# EAGLE design ArduinoUNOSheild (EAGLE 9.6.2)
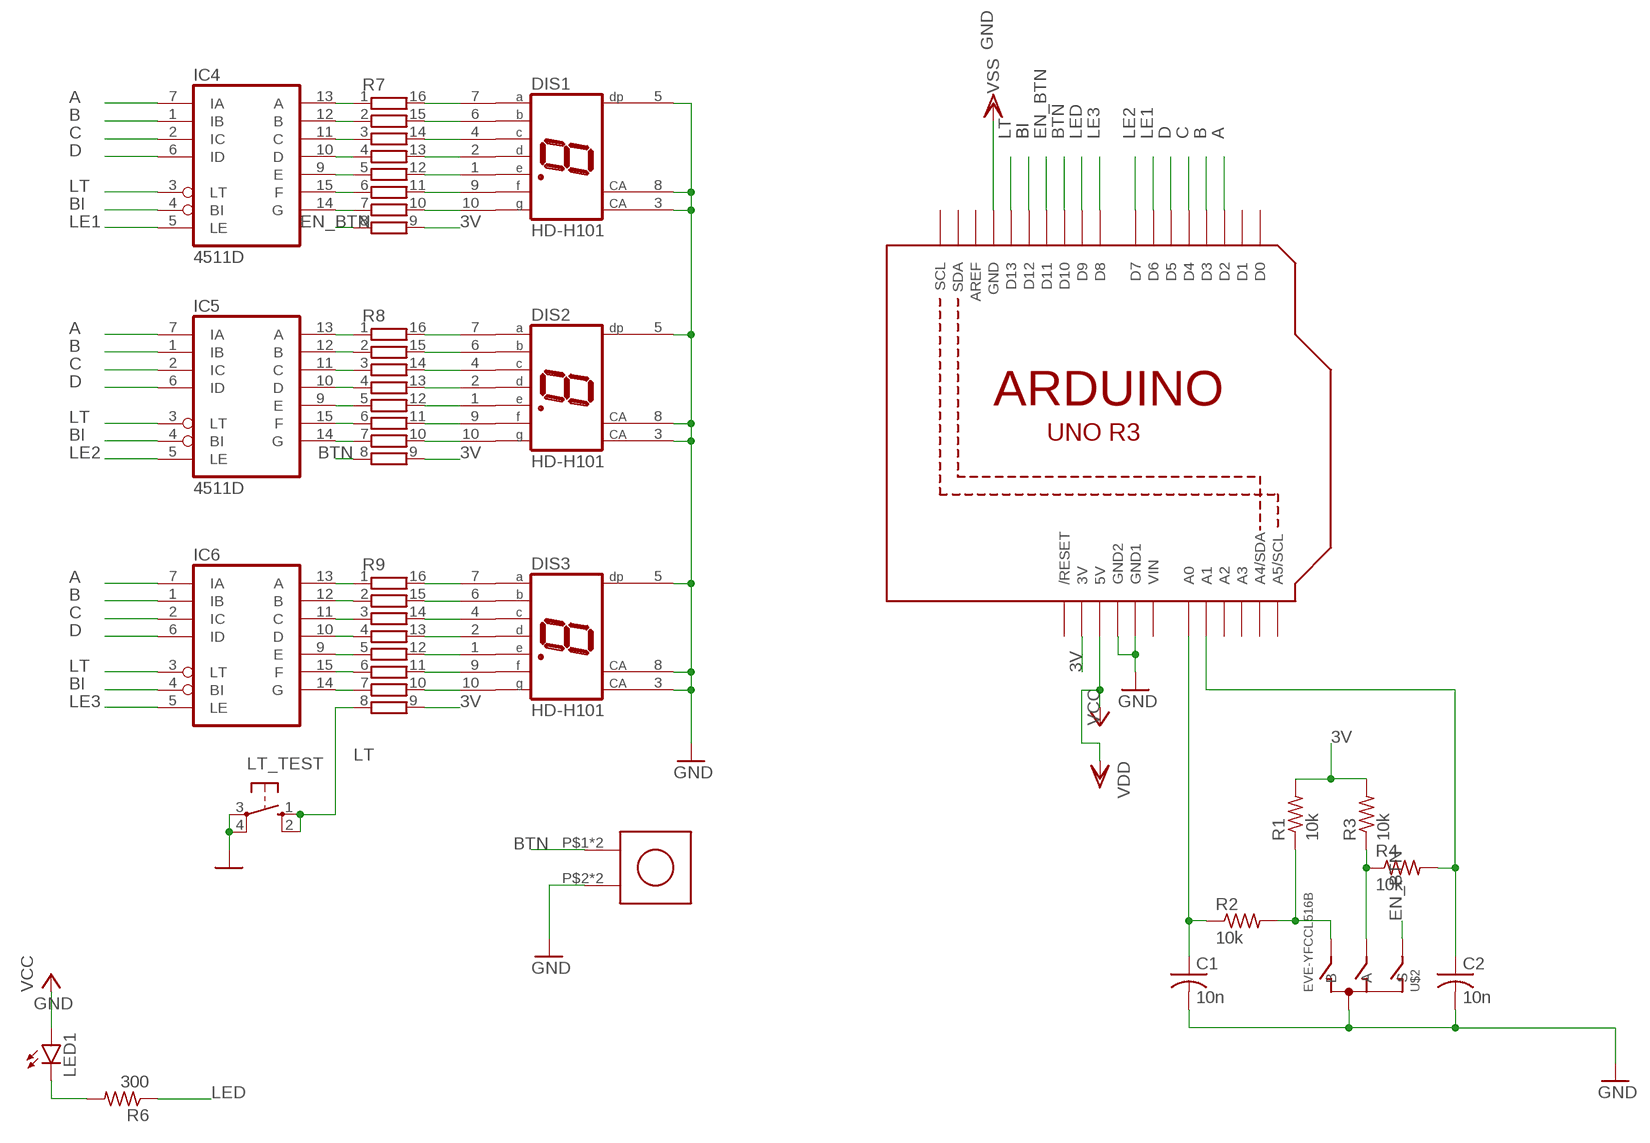
[diagram p0: schematic, sheet 1]

## Parts
C1  10n  C-USC0603  [C0603]
C2  10n  C-USC0603  [C0603]
DIS1  HD-H101  [HDSP-M]
DIS2  HD-H101  [HDSP-M]
DIS3  HD-H101  [HDSP-M]
IC4  4511D  [SO16]
IC5  4511D  [SO16]
IC6  4511D  [SO16]
LED1  LEDCHIP-LED0805  [CHIP-LED0805]
LT_TEST  10-XX  [B3F-10XX]
R1  10k  R-US_R0603  [R0603]
R2  10k  R-US_R0603  [R0603]
R3  10k  R-US_R0603  [R0603]
R4  10k  R-US_R0603  [R0603]
R6  300  R-US_R0603  [R0603]
R7  4816P-T01  [4816P]
R8  4816P-T01  [4816P]
R9  4816P-T01  [4816P]
U1  ARDUINOR3-NOIOREF-NOTEXT  [ARDUINOR3-NOTEXT-NOIOREF]
U$1  AE1027  [BUTTON5X13MM]
U$2  EVE-YFCCL516B  [PANASONIC_EVE_Y]

## Nets
3V: R1.2 R3.2 R7.9 R8.9 R9.9 U1.3V
A: IC4.7(IA) IC5.7(IA) IC6.7(IA) U1.D2
A1: C2.1 R4.2 U1.A1
B: IC4.1(IB) IC5.1(IB) IC6.1(IB) U1.D3
BI: IC4.4(BI) IC5.4(BI) IC6.4(BI) U1.D12
BTN: R8.8 U1.D10 U$1.P$1 U$1.P$11
C: IC4.2(IC) IC5.2(IC) IC6.2(IC) U1.D4
D: IC4.6(ID) IC5.6(ID) IC6.6(ID) U1.D5
EN_BTN: R7.8 U1.D11 U$2.S
GND: C1.2 C2.2 DIS1.3(CA) DIS1.5(DP) DIS1.8(CA) DIS2.3(CA) DIS2.5(DP) DIS2.8(CA) DIS3.3(CA) DIS3.5(DP) DIS3.8(CA) LT_TEST.3(P) LT_TEST.4(P1) U1.GND U1.GND1 U1.GND2 U$1.P$2 U$1.P$12 U$2.COM(C) U$2.GND1(C) U$2.GND(C) ; supply symbol labelled VSS
LE1: IC4.5(LE) U1.D6
LE2: IC5.5(LE) U1.D7
LE3: IC6.5(LE) U1.D8
LED: R6.1 U1.D9
LED_N: LED1.C R6.2
LT: IC4.3(LT) IC5.3(LT) IC6.3(LT) LT_TEST.1(S) LT_TEST.2(S1) R9.8 U1.D13
N$1: DIS1.7(A) R7.16
N$2: DIS1.6(B) R7.15
N$3: DIS1.4(C) R7.14
N$4: DIS1.2(D) R7.13
N$5: DIS1.1(E) R7.12
N$7: DIS1.9(F) R7.11
N$8: DIS1.10(G) R7.10
N$9: DIS2.7(A) R8.16
N$10: DIS2.6(B) R8.15
N$11: DIS2.4(C) R8.14
N$12: DIS2.2(D) R8.13
N$13: DIS2.1(E) R8.12
N$14: DIS2.9(F) R8.11
N$15: DIS2.10(G) R8.10
N$16: DIS3.7(A) R9.16
N$17: DIS3.6(B) R9.15
N$18: DIS3.4(C) R9.14
N$19: DIS3.2(D) R9.13
N$20: DIS3.1(E) R9.12
N$21: DIS3.9(F) R9.11
N$22: DIS3.10(G) R9.10
N$23: R1.1 R2.2 U$2.B U$2.B1(B)
N$24: C1.1 R2.1 U1.A0
N$26: R3.1 R4.1 U$2.A
N$27: IC4.13(A) R7.1
N$28: IC4.12(B) R7.2
N$29: IC4.11(C) R7.3
N$30: IC4.10(D) R7.4
N$31: IC4.9(E) R7.5
N$32: IC4.15(F) R7.6
N$33: IC4.14(G) R7.7
N$34: IC5.13(A) R8.1
N$35: IC5.12(B) R8.2
N$36: IC5.11(C) R8.3
N$37: IC5.10(D) R8.4
N$38: IC5.9(E) R8.5
N$39: IC5.15(F) R8.6
N$40: IC5.14(G) R8.7
N$41: IC6.13(A) R9.1
N$42: IC6.12(B) R9.2
N$43: IC6.11(C) R9.3
N$44: IC6.10(D) R9.4
N$45: IC6.9(E) R9.5
N$46: IC6.15(F) R9.6
N$47: IC6.14(G) R9.7
VCC: LED1.A U1.5V ; supply symbol labelled VDD, +5V
Unconnected: U1.A2 U1.A3 U1.A4(A4/SDA) U1.A5(A5/SCL) U1.AREF U1.D0 U1.D1 U1.RESET(/RESET) U1.SCL U1.SDA

## Power pins joined to a net without a drawn wire
GND: IC4.8(VSS) IC5.8(VSS) IC6.8(VSS)
VCC: IC4.16(VDD) IC5.16(VDD) IC6.16(VDD)
VIN: U1.VIN

## Library data of the parts
C1 C2 = rcl:C-US: CAPACITOR, American symbol; SPICEPREFIX: C
DIS1-DIS3 = display-hp:HD-H101: LED DISPLAY 1-character 7 segment, decimal point right; OC_FARNELL: unknown; OC_NEWARK: unknown
IC4-IC6 = 45xx:4511: BCD to 7-segment LATCH/DECODER/DRIVER
LED1 = led:LED: LED OSRAM: - CHIPLED LG R971, LG N971, LY N971, LG Q971, LY Q971, LO R971, LY R971 LH N974, LH R974 LS Q976, LO Q976, LY Q976 LO Q996 - Hyper CHIPLED LW Q18S LB Q993, LB Q99A, LB R99A - SideLED LS A670, LO A670, LY A670, LG A670, LP A670 LB A673, LV A673, LT A673, LW A673 LH A674 LY A675 LS A676, LA A676, LO A676, LY A676, LW A676 LS A679, LY A679, LG A679 - Hyper Micro SIDELED® LS Y876, LA Y876, LO Y876, LY Y876 LT Y87S - SmartLED LW L88C, LW L88S LB L89C, LB L89S, LG L890 LS L89K, LO L89K, LY L89K LS L896, LA L896, LO L896, LY L896 - TOPLED LS T670, LO T670, LY T670, LG T670, LP T670 LSG T670, LSP T670, LSY T670, LOP T670, LYG T670 LG T671, LOG T671, LSG T671 LB T673, LV T673, LT T673, LW T673 LH T674 LS T676, LA T676, LO T676, LY T676, LB T676, LH T676, LSB T676, LW T676 LB T67C, LV T67C, LT T67C, LS T67K, LO T67K, LY T67K, LW E67C LS E67B, LA E67B, LO E67B, LY E67B, LB E67C, LV E67C, LT E67C LW T67C LS T679, LY T679, LG T679 LS T770, LO T770, LY T770, LG T770, LP T770 LB T773, LV T773, LT T773, LW T773 LH T774 LS E675, LA E675, LY E675, LS T675 LS T776, LA T776, LO T776, LY T776, LB T776 LHGB T686 LT T68C, LB T68C - Hyper Mini TOPLED® LB M676 - Mini TOPLED Santana® LG M470 LS M47K, LO M47K, LY M47K Source: http://www.osram.convergy.de LUXEON: - LUMILED® LXK2-PW12-R00, LXK2-PW12-S00, LXK2-PW14-U00, LXK2-PW14-V00 LXK2-PM12-R00, LXK2-PM12-S00, LXK2-PM14-U00 LXK2-PE12-Q00, LXK2-PE12-R00, LXK2-PE12-S00, LXK2-PE14-T00, LXK2-PE14-U00 LXK2-PB12-K00, LXK2-PB12-L00, LXK2-PB12-M00, LXK2-PB14-N00, LXK2-PB14-P00, LXK2-PB14-Q00 LXK2-PR12-L00, LXK2-PR12-M00, LXK2-PR14-Q00, LXK2-PR14-R00 LXK2-PD12-Q00, LXK2-PD12-R00, LXK2-PD12-S00 LXK2-PH12-R00, LXK2-PH12-S00 LXK2-PL12-P00, LXK2-PL12-Q00, LXK2-PL12-R00 Source: www.luxeon.com KINGBRIGHT: KA-3528ASYC Source: www.kingbright.com
LT_TEST = switch-omron:10-XX: OMRON SWITCH; MPN: B3F-1000; OC_FARNELL: 176432; OC_NEWARK: 36M3542
R1-R4 R6 = rcl:R-US_: RESISTOR, American symbol; SPICEPREFIX: R
R7-R9 = resistor-bourns:4816P-T01: BOURNS RESISTOR NETWORK; MF: BOURNS, INC.; MPN: 4816P-T01-684LF; OC_FARNELL: 9357483; OC_NEWARK: 33K0707
U1 = adafruit:ARDUINOR3-NOIOREF
U$1 = Button12mm:AE1027: AE1027 Gikfun 12*12*7.3mm Tact Tactile Button/Press Switch
U$2 = EVE-YFCCL516B:EVE-YFCCL516B

## Net classes
0 default: width 0.051 mm, drill 0.076 mm, clearance 0.051 mm

## Board
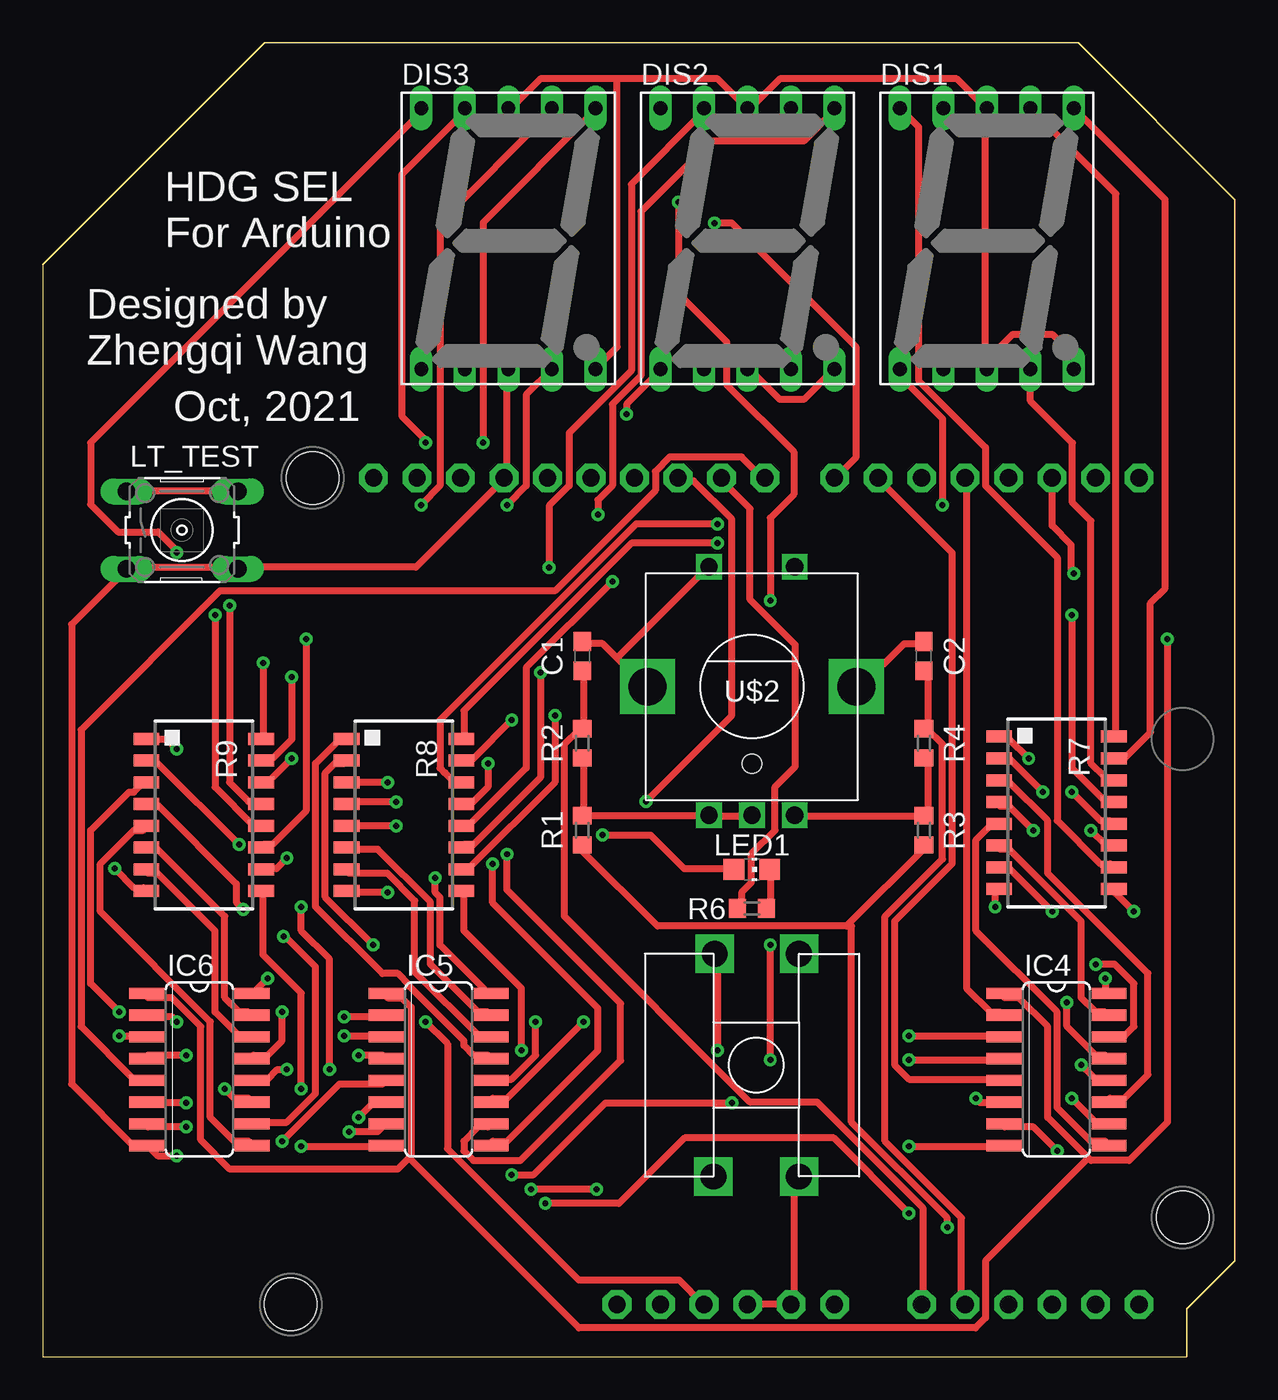
[diagram p1: board, top side]
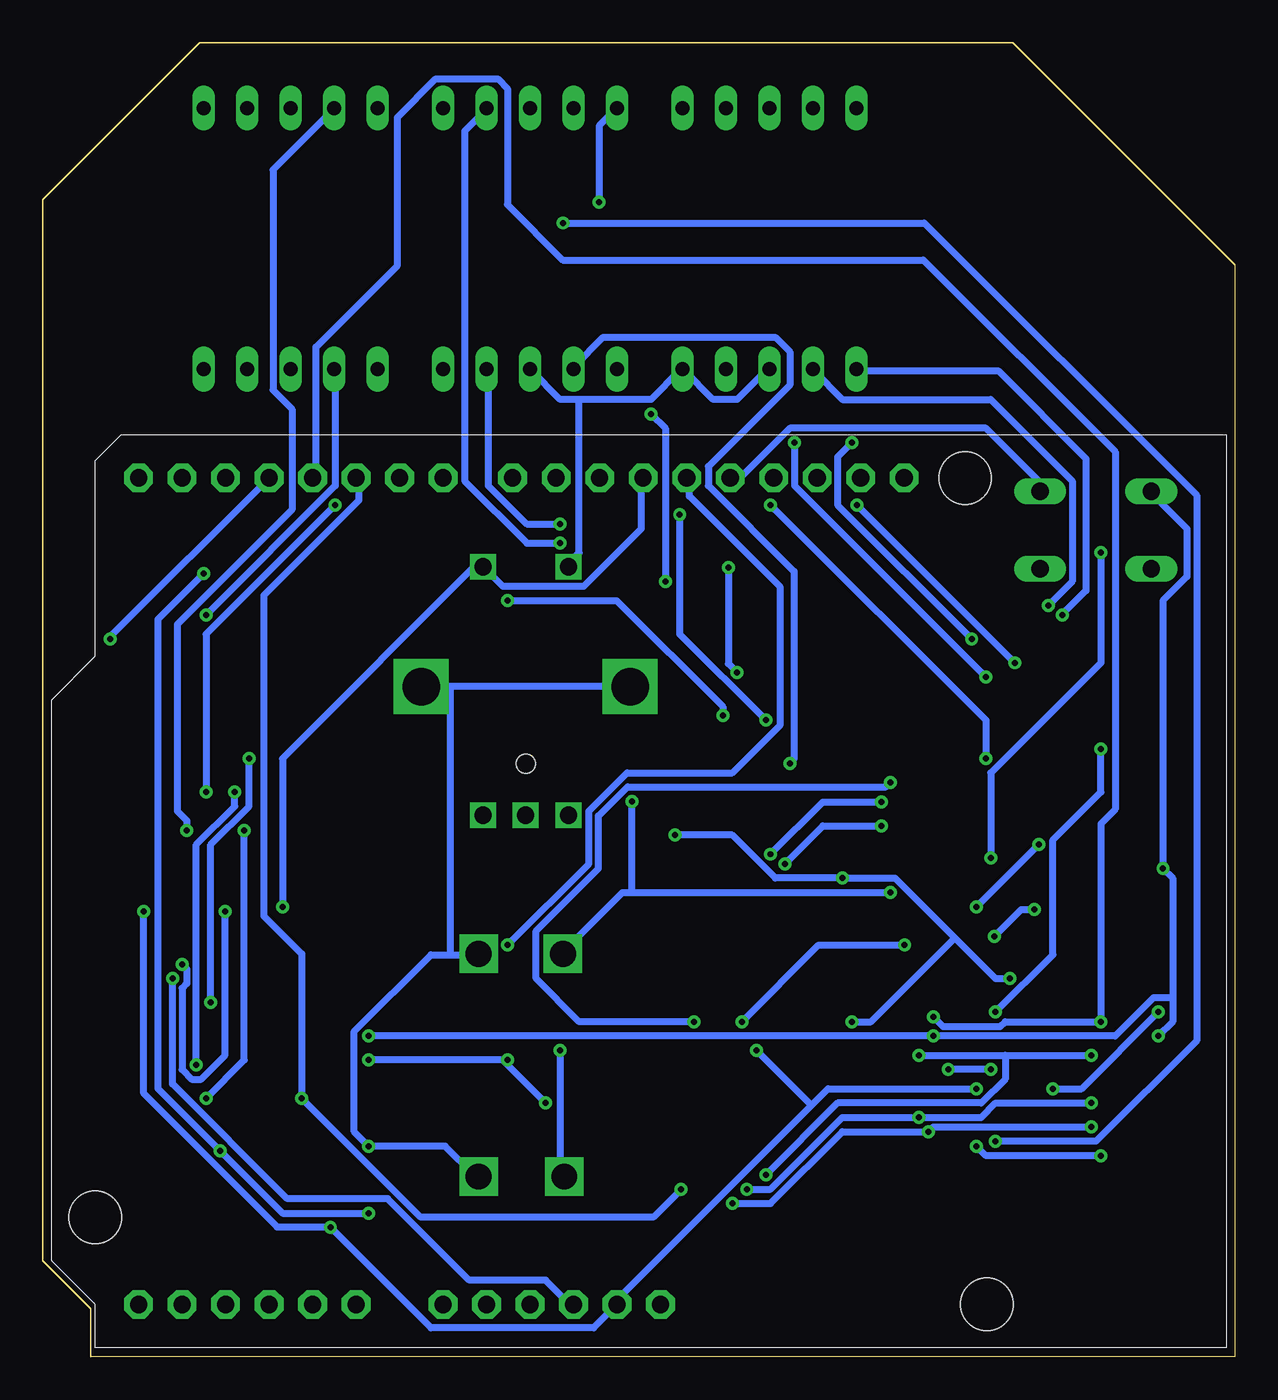
[diagram p2: board, bottom side, seen from below]

Size 69.6 x 76.71 mm. Coordinates in mm from the lower left corner, seen from the top.
Outline: 0,0 66.8,0 66.8,2.79 69.6,5.59 69.6,67.56 60.45,76.71 12.95,76.71 0,63.75 0,0
Copper layers (1*16): Top 0.035mm / dielectric 1.5mm / Bottom 0.035mm
Design rules "default *": minimum track width 16mil, minimum drill 0.35mm, track to track 6mil, track to pad 6mil, pad to pad 6mil, via to via 6mil, smd to smd 6mil, copper to edge 40mil, drill to drill 6mil, minimum pad ring 10mil, minimum via ring 8mil, stop-mask expansion 4mil, vias tented up to drill 0mil, thermal gap 10mil
Holes 3.05 mm at 14.48,3.05 66.55,8.13 15.75,51.31

### Footprints (pad centres in the part's own frame; a part is rotated, then mirrored left to right if it is on the bottom)
C0603 = smd 1.1 x 1: 1 -0.85,0; 2 0.85,0
HDSP-M = drill 0.813 long: 1 -5.08,-7.62; 2 -2.54,-7.62; 3 0,-7.62; 4 2.54,-7.62; 5 5.08,-7.62; 6 5.08,7.62; 7 2.54,7.62; 8 0,7.62; 9 -2.54,7.62; 10 -5.08,7.62
SO16 = smd 0.66 x 2.032: 1 -4.445,-3.073; 2 -3.175,-3.073; 3 -1.905,-3.073; 4 -0.635,-3.073; 5 0.635,-3.073; 6 1.905,-3.073; 7 3.175,-3.073; 8 4.445,-3.073; 9 4.445,3.073; 10 3.175,3.073; 11 1.905,3.073; 12 0.635,3.073; 13 -0.635,3.073; 14 -1.905,3.073; 15 -3.175,3.073; 16 -4.445,3.073
CHIP-LED0805 = smd 1.2 x 1.2: A 0,-1.05; C 0,1.05
B3F-10XX = drill 1.016 long: 1 -3.251,2.261; 2 3.251,2.261; 3 -3.251,-2.261; 4 3.251,-2.261
R0603 = smd 1 x 1.1: 1 -0.85,0; 2 0.85,0
4816P = smd 0.7 x 1.5: 1 -4.445,-3.346; 2 -3.175,-3.346; 3 -1.905,-3.346; 4 -0.635,-3.346; 5 0.635,-3.346; 6 1.905,-3.346; 7 3.175,-3.346; 8 4.445,-3.346; 9 4.445,3.346; 10 3.175,3.346; 11 1.905,3.346; 12 0.635,3.346; 13 -0.635,3.346; 14 -1.905,3.346; 15 -3.175,3.346; 16 -4.445,3.346
ARDUINOR3-NOTEXT-NOIOREF = drill 1 pad 1.676 octagon: 3V 35.56,2.54; 5V 38.1,2.54; A0 50.8,2.54; A1 53.34,2.54; A2 55.88,2.54; A3 58.42,2.54; A4 60.96,2.54; A5 63.5,2.54; AREF 23.876,50.8; D0 63.5,50.8; D1 60.96,50.8; D2 58.42,50.8; D3 55.88,50.8; D4 53.34,50.8; D5 50.8,50.8; D6 48.26,50.8; D7 45.72,50.8; D8 41.656,50.8; D9 39.116,50.8; D10 36.576,50.8; D11 34.036,50.8; D12 31.496,50.8; D13 28.956,50.8; GND 26.416,50.8; GND1 43.18,2.54; GND2 40.64,2.54; RESET 33.02,2.54; SCL 18.796,50.8; SDA 21.336,50.8; VIN 45.72,2.54
BUTTON5X13MM = drill 1.5 square: P$1 -2.5,-6.5; P$2 2.5,-6.5; P$11 -2.424,6.5; P$12 2.5,6.5
PANASONIC_EVE_Y = drill 1 square: A 2.5,-7.5; B -2.5,-7.5; B1 0,-7.5; COM -2.5,7; S 2.5,7 | drill 2.2 square: GND -6.1,0; GND1 6.1,0 | hole 1.1: 0,-4.5

### Placement (x,y rotation side)
C1  31.5,40.89 90 top
C2  51.44,40.89 90 top
DIS1  55.12,65.28 0 top
DIS2  41.15,65.28 0 top
DIS3  27.18,65.28 0 top
IC4  59.18,16.76 270 top
IC5  23.11,16.76 270 top
IC6  9.14,16.76 270 top
LED1  41.4,28.45 270 top
LT_TEST  8.13,48.26 0 top
R1  31.5,30.73 270 top
R2  31.5,35.81 270 top
R3  51.44,30.73 270 top
R4  51.44,35.81 90 top
R6  41.4,26.16 0 top
R7  59.18,31.75 270 top
R8  21.08,31.62 270 top
R9  9.4,31.62 270 top
U1  0.51,0.51 0 top
U$1  41.65,17.02 0 top
U$2  41.4,39.12 0 top

### Tracks (layer width: path | path; a pad name or v marks a point on that pad's centre or on a via)
3V  (via drill 0.35)
  Top 0.406: R1.2 31.5,29.54 35.89,25.15 46.94,25.15 47.08,25.29 | 47.08,25.29 51.41,29.62 R3.2 | v15.09,15.65 15.09,21.23 12.85,23.47 12.85,27.1 R9.9 | v27.94,17.88 27.94,21.51 24.59,24.87 24.59,27.1 R8.9 | v63.7,25.98 62.59,27.1 R7.9 | v52.81,7.54 52.81,8.1 47.22,13.69 47.22,25.15 47.08,25.29
  Bottom 0.406: v15.09,15.65 23.75,15.65 24.73,14.67 | 24.73,14.67 36.32,3.07 U1.3V 37.44,1.68 46.94,1.68 v52.81,7.54 52.84,7.58 55.92,7.58 63.7,15.37 v63.7,25.98 | 24.73,14.67 v27.94,17.88
A  (via drill 0.35)
  Top 0.406: v8.38,13.41 6.15,13.41 IC6.7 | v17.88,13.13 19.56,13.13 19.84,13.41 IC5.7 | v59.23,12.01 57.84,13.41 56.16,13.41 IC4.7 | v29.34,8.94 33.63,8.94 37.47,12.78 46.18,12.78 v50.57,8.38 | v60.2,45.72 60.05,45.87 60.05,47.4 58.93,48.52 U1.D2
  Bottom 0.406: v8.38,13.41 17.6,13.41 v17.88,13.13 22.91,13.13 27.1,8.94 v29.34,8.94 | v50.57,8.38 55.6,8.38 v59.23,12.01 62.87,15.65 62.87,43.05 v60.2,45.72
A1
  Top 0.406: C2.1 51.69,39.95 51.69,36.88 R4.2 51.69,36.6 52.53,35.76 52.53,29.06 49.17,25.7 49.17,12.57 53.65,8.1 53.65,3.07 U1.A1
B  (via drill 0.35)
  Top 0.406: 21.37,11.6 21.51,11.73 21.51,20.4 20.95,20.95 20.12,20.95 IC5.1 | 21.37,11.6 20.73,10.95 10.92,10.95 9.22,12.65 9.22,19.28 7.54,20.95 6.15,20.95 IC6.1 | 61.05,11.6 61.19,11.46 63.42,11.46 65.66,13.69 v65.66,41.91 | 61.05,11.6 58.67,13.97 58.67,19.28 57,20.95 56.16,20.95 IC4.1 | 21.37,11.6 31.29,1.68 54.46,1.68 55.04,2.26 55.04,5.59 61.05,11.6
  Bottom 0.406: U1.D3 65.66,42.04 v65.66,41.91
BI  (via drill 0.35)
  Top 0.406: v8.38,17.6 6.15,17.6 IC6.4 | v18.44,17.6 19.84,17.6 IC5.4 | v50.57,17.32 55.88,17.32 IC4.4 | v40.23,14.81 32.84,14.81 28.65,10.62 v27.38,10.62 | v42.47,17.32 v42.47,24.03
  Bottom 0.406: v18.44,17.6 13.41,17.6 | 13.41,17.6 v8.38,17.6 | v50.57,17.32 42.75,17.32 42.61,17.18 | v40.23,14.81 42.61,17.18 | v27.38,10.62 23.19,14.81 14.81,14.81 13.41,16.2 13.41,17.6 | v42.47,24.03 37.72,28.78 37.72,31.85 35.48,34.09 29.34,34.09 26.54,36.88 26.54,44.93 31.85,50.24 31.85,51.13 U1.D12 | v42.47,17.32 42.61,17.18
BTN  (via drill 0.35)
  Top 0.406: v20.12,27.1 17.88,27.1 R8.8 | v35.2,32.41 40.23,37.44 40.23,48.9 38,51.13 37.16,51.13 U1.D10 | v39.4,17.88 39.4,23.47 U$1.P$11
  Bottom 0.406: 35.2,27.1 35.76,27.1 39.12,23.75 U$1.P$11 | 35.2,27.1 v20.12,27.1 | 35.2,27.1 v35.2,32.41 | v39.4,17.88 39.4,10.62 U$1.P$1
C  (via drill 0.35)
  Top 0.406: v7.82,19.56 7.54,19.84 6.15,19.84 IC6.2 | v17.6,19.84 19.84,19.84 IC5.2 | IC4.2 55.88,20.12 55.32,20.12 53.92,21.51 53.92,51.13 U1.D4
  Bottom 0.406: v17.6,19.84 17.04,19.28 13.69,19.28 13.41,19.56 v7.82,19.56 7.82,31.11 6.99,31.95 6.99,52.83 18.19,64.03 39.24,64.03 42.47,67.26 42.47,74.04 43.03,74.6 46.66,74.6 48.9,72.36 48.9,63.7 53.65,58.95 53.65,51.41 U1.D4
D  (via drill 0.35)
  Top 0.406: v8.38,14.81 6.15,14.81 IC6.6 | v18.44,13.97 19.28,14.81 19.84,14.81 IC5.6 | IC4.6 56.08,14.83 54.74,14.83 v54.48,15.09 | v32.33,9.78 v28.5,9.78
  Bottom 0.406: v8.38,14.81 13.97,14.81 14.81,13.97 v18.44,13.97 22.91,13.97 27.1,9.78 v28.5,9.78 | U1.D5 51.16,51.16 51.16,49.99 56.69,44.45 56.69,25.73 54.48,23.52 v54.48,15.09 47.57,8.18 33.91,8.18 32.33,9.75 v32.33,9.78
EN_BTN  (via drill 0.35)
  Top 0.406: v55.6,26.26 55.6,27.1 R7.8
  Bottom 0.406: v55.6,26.26 55.6,34.92 44.15,46.38 U$2.S 43.87,46.1 42.75,44.98 38,44.98 34.65,48.34 34.65,51.13 U1.D11
GND  (via drill 0.35)
  Top 0.406: v15.09,12.29 19.84,12.29 IC5.8 | v7.82,11.73 6.71,11.73 6.15,12.29 IC6.8 5.28,12.32 1.68,15.93 1.68,42.75 4.75,45.82 LT_TEST.3 5.03,46.1 11.18,46.1 LT_TEST.4 11.46,46.1 21.79,46.1 26.82,51.13 U1.GND 27.1,51.41 27.1,57.56 DIS3.3 | 33.53,74.6 39.4,74.6 41.07,72.92 DIS2.8 41.35,72.92 43.03,74.6 53.37,74.6 55.04,72.92 DIS1.8 55.04,72.64 55.04,57.84 DIS1.3 55.12,58.17 56.64,59.69 58.93,59.69 60.2,58.42 DIS1.5 | 33.53,74.6 29.06,74.6 27.38,72.92 DIS3.8 | U1.GND2 41.35,3.07 43.59,3.07 U1.GND1 43.87,3.07 43.87,10.06 44.15,10.34 U$1.P$2 | v50.57,12.29 55.88,12.29 IC4.8 | DIS2.3 41.35,57.56 43.03,55.88 44.42,55.88 46.1,57.56 DIS2.5 | C2.2 51.41,41.63 50.29,41.63 47.78,39.12 U$2.GND1 | 33.53,40.79 35.2,39.12 U$2.GND | 33.53,40.79 32.69,41.63 31.57,41.63 C1.2 | 33.53,40.79 38.84,46.1 U$2.COM | 33.53,74.6 33.53,58.95 32.41,57.84 DIS3.5
  Bottom 0.406: v15.09,12.29 14.53,11.73 v7.82,11.73 | U$1.P$2 44.42,10.62 46.1,12.29 v50.57,12.29 51.41,13.13 51.41,19 46.94,23.47 45.82,23.47 | 45.82,23.47 44.42,23.47 U$1.P$12 | DIS3.3 27.38,57.56 29.06,55.88 30.45,55.88 32.13,57.56 DIS3.5 32.41,57.56 34.09,55.88 38.28,55.88 | 38.28,55.88 39.4,55.88 41.07,57.56 DIS2.3 | U$2.GND 45.82,39.12 | 45.82,39.12 U$2.GND1 | 38.28,55.88 38.28,46.94 38.84,46.38 U$2.COM | 45.82,39.12 45.82,23.47
LE1
  Top 0.406: IC4.5 55.88,16.2 50.57,16.2 49.73,17.04 49.73,25.43 53.09,28.78 53.09,46.94 48.9,51.13 U1.D6
LE2  (via drill 0.35)
  Top 0.406: v13.97,12.57 17.32,15.93 19.84,15.93 IC5.5 | v39.22,66.19 40.23,66.19 47.5,58.93 47.5,52.53 46.38,51.41 U1.D7
  Bottom 0.406: v13.97,12.57 8.1,12.57 2.23,18.44 2.23,50.29 18.14,66.19 v39.22,66.19
LE3
  Top 0.406: IC6.5 5.87,16.2 5.31,16.2 2.23,19.28 2.23,36.6 10.34,44.7 29.9,44.7 35.76,50.57 35.76,51.69 36.6,52.53 40.79,52.53 41.91,51.41 U1.D8
LED
  Top 0.406: R6.1 40.79,26.26 40.79,27.1 41.35,27.66 41.35,29.34 42.75,30.73 42.75,33.27 43.94,34.47 43.94,41.55 41.3,44.2 41.3,49.51 39.67,51.13 U1.D9
LED_N
  Top 0.406: R6.2 42.47,26.26 42.47,28.22 LED1.C
LT  (via drill 0.35)
  Top 0.406: v4.19,28.5 5.31,27.38 5.87,27.38 R9.8 | v4.47,18.72 5.87,18.72 IC6.3 | v17.6,18.72 19.84,18.72 IC5.3 | v50.57,18.72 55.88,18.72 IC4.3 | LT_TEST.2 11.18,50.57 5.03,50.57 LT_TEST.1
  Bottom 0.406: LT_TEST.1 4.75,50.29 2.79,48.34 2.79,45.54 4.19,44.15 v4.19,28.5 3.63,27.94 3.63,20.95 | v4.47,18.72 3.63,19.56 3.63,20.95 | 3.63,20.95 4.75,20.95 6.99,18.72 v17.6,18.72 v50.57,18.72 | U1.D13 29.34,51.41 28.78,51.41 25.98,54.2 14.53,54.2 11.46,51.13 11.46,50.57 LT_TEST.2
N$1
  Top 0.406: R7.16 62.66,36.49 62.66,67.89 DIS1.7
N$2
  Top 0.406: R7.15 63.14,34.92 64.67,36.45 64.67,43.99 65.53,44.85 65.53,67.56 DIS1.6
N$3
  Top 0.406: R7.14 62.31,33.81 62.03,33.81 61.19,34.65 61.19,48.79 60.12,49.86 60.12,53.34 57.66,55.8 DIS1.4
N$4  (via drill 0.35)
  Top 0.406: v60.07,43.31 60.07,34.37 62.03,32.41 62.31,32.41 R7.13
  Bottom 0.406: v60.07,43.31 52.53,50.85 52.53,57.56 DIS1.2
N$5  (via drill 0.35)
  Top 0.406: v60.07,32.97 61.75,31.29 62.31,31.29 R7.12 | v52.53,49.73 52.53,54.76 50.29,57 50.29,57.56 DIS1.1
  Bottom 0.406: v60.07,32.97 60.07,42.19 v52.53,49.73
N$7  (via drill 0.35)
  Top 0.406: v61.19,30.73 62.03,29.9 62.31,29.9 R7.11
  Bottom 0.406: v61.19,30.73 61.19,31.29 61.75,31.85 61.75,42.75 55.04,49.45 55.04,55.32 56.16,56.44 56.16,69.29 52.81,72.64 DIS1.9
N$8
  Top 0.406: DIS1.10 51.13,71.81 51.13,57 55.04,53.09 55.04,50.85 59.23,46.66 59.23,31.29 61.75,28.78 62.31,28.78 R7.10
N$9  (via drill 0.35)
  Top 0.406: v39.4,47.5 34.37,47.5 24.59,37.72 24.59,36.32 R8.16
  Bottom 0.406: v39.4,47.5 41.33,47.5 44.96,51.13 44.96,71.55 43.87,72.64 DIS2.7
N$10  (via drill 0.35)
  Top 0.406: v27.38,37.16 25.15,34.92 24.59,34.92 R8.15 | v32.41,49.17 32.41,50.01 33.25,50.85 33.25,55.6 34.92,57.28 34.92,66.85 39.04,70.97 44.42,70.97 46.1,72.64 DIS2.6
  Bottom 0.406: v27.38,37.16 32.41,42.19 v32.41,49.17
N$11  (via drill 0.35)
  Top 0.406: v39.4,48.62 34.65,48.62 23.19,37.16 23.19,34.37 23.47,34.09 23.5,34.09 24.05,33.53 R8.14
  Bottom 0.406: v39.4,48.62 41.35,48.62 43.59,50.85 43.59,57.56 DIS2.4
N$12  (via drill 0.35)
  Top 0.406: v25.98,34.65 25.98,33.25 25.15,32.41 24.59,32.41 R8.13
  Bottom 0.406: v25.98,34.65 25.73,34.9 25.73,45.85 30.73,50.85 30.73,51.97 25.98,56.72 25.98,58.67 26.82,59.51 36.88,59.51 38.56,57.84 DIS2.2
N$13  (via drill 0.35)
  Top 0.406: v33.25,45.26 28.22,40.23 28.22,34.37 24.87,31.01 24.59,31.01 R8.12 | v34.09,55.04 34.09,55.6 36.04,57.56 DIS2.1
  Bottom 0.406: v33.25,45.26 33.25,54.2 v34.09,55.04
N$14  (via drill 0.35)
  Top 0.406: v29.06,39.95 29.06,33.81 25.15,29.9 24.59,29.9 R8.11 | v29.57,46.08 29.57,49.68 30.73,50.85 30.73,53.92 34.37,57.56 34.37,68.45 38.56,72.64 DIS2.9
  Bottom 0.406: v29.57,46.08 29.57,40.46 v29.06,39.95
N$15  (via drill 0.35)
  Top 0.406: v29.9,37.44 29.9,33.53 24.87,28.5 24.59,28.5 R8.10 | v42.47,44.15 42.47,48.97 43.84,50.34 43.84,52.83 39.93,56.74 39.93,59.26 37.11,62.08 v37.11,67.41
  Bottom 0.406: v29.9,37.44 29.9,37.95 36.09,44.15 v42.47,44.15 | v37.11,67.41 37.11,71.86 DIS2.10
N$16  (via drill 0.35)
  Top 0.406: v12.85,40.51 12.85,36.32 R9.16 | v22.07,49.73 23.19,50.85 23.19,66.22 29.62,72.64 DIS3.7
  Bottom 0.406: v22.07,49.73 v12.85,40.51
N$17  (via drill 0.35)
  Top 0.406: v14.53,39.67 14.53,36.04 13.41,34.92 12.85,34.92 R9.15 | v25.7,53.37 25.7,66.22 32.13,72.64 DIS3.6
  Bottom 0.406: v14.53,39.67 25.7,50.85 v25.7,53.37
N$18  (via drill 0.35)
  Top 0.406: v14.53,34.92 13.18,33.58 12.9,33.58 12.85,33.53 R9.14 | v27.1,49.73 28.22,50.85 28.22,56.16 DIS3.4
  Bottom 0.406: v14.53,34.92 14.53,37.16 v27.1,49.73
N$19  (via drill 0.35)
  Top 0.406: v10.9,43.87 10.9,33.53 12.01,32.41 12.57,32.41 R9.13
  Bottom 0.406: v10.9,43.87 9.5,45.26 9.5,51.13 14.25,55.88 22.91,55.88 24.59,57.56 DIS3.2
N$20  (via drill 0.35)
  Top 0.406: v10.06,43.31 10.06,33.25 12.29,31.01 12.57,31.01 R9.12
  Bottom 0.406: v10.06,43.31 10.06,43.36 8.69,44.73 8.69,52.43 13.82,57.56 22.07,57.56 DIS3.1
N$21  (via drill 0.35)
  Top 0.406: v15.37,41.91 15.37,31.85 13.41,29.9 12.85,29.9 R9.11 | v22.35,53.37 22.35,53.52 20.95,54.91 20.95,69.01 24.59,72.64 DIS3.9
  Bottom 0.406: v15.37,41.91 23.19,49.73 23.19,52.53 v22.35,53.37
N$22  (via drill 0.35)
  Top 0.406: v14.25,29.11 13.64,28.5 12.85,28.5 R9.10 | v7.82,46.94 7.82,47.07 6.73,48.16 4.39,48.16 2.79,49.76 2.79,53.37 22.07,72.64 DIS3.10
  Bottom 0.406: v14.25,29.11 14.25,34.09 7.82,40.51 v7.82,46.94
N$23
  Top 0.406: R2.2 31.57,34.92 31.57,31.85 R1.1 31.57,31.57 38.84,31.57 U$2.B 39.12,31.57 41.35,31.57 U$2.B1
N$24
  Top 0.406: C1.1 31.57,39.95 31.57,36.88 R2.1 31.29,36.6 30.45,35.76 30.45,25.7 41.3,14.86 45.21,14.86 51.41,8.66 51.41,3.07 U1.A0
N$26
  Top 0.406: R4.1 51.69,34.92 51.69,31.85 R3.1 51.41,31.57 44.15,31.57 U$2.A
N$27  (via drill 0.35)
  Top 0.406: v57.56,34.92 56.44,36.04 55.88,36.04 R7.1 | v59.79,20.68 59.79,19.28 61.47,17.6 62.03,17.6 IC4.13
  Bottom 0.406: v57.56,34.92 57.56,32.13 59.79,29.9 v59.79,20.68
N$28  (via drill 0.35)
  Top 0.406: R7.2 56.44,34.92 v58.4,32.97 | v60.63,17.04 61.47,16.2 62.03,16.2 IC4.12
  Bottom 0.406: v58.4,32.97 58.4,32.13 60.63,29.9 v60.63,17.04
N$29
  Top 0.406: R7.3 55.88,33.53 56.44,33.53 58.67,31.29 58.67,28.22 64.52,22.38 64.52,16.46 63.14,15.09 62.31,15.09 IC4.11
N$30  (via drill 0.35)
  Top 0.406: v57.84,30.73 56.44,32.13 55.88,32.13 R7.4 | v60.07,15.09 61.47,13.69 62.03,13.69 IC4.10
  Bottom 0.406: v57.84,30.73 57.84,17.32 v60.07,15.09
N$31
  Top 0.406: R7.5 55.6,31.01 55.32,31.01 54.48,30.18 54.48,24.87 59.23,20.12 59.23,14.53 61.19,12.57 62.03,12.57 IC4.9
N$32
  Top 0.406: R7.6 55.88,29.62 56.44,29.62 60.63,25.43 60.63,20.95 61.47,20.12 62.03,20.12 IC4.15
N$33  (via drill 0.35)
  Top 0.406: v58.95,25.98 56.44,28.5 55.88,28.5 R7.7 | v61.47,22.91 62.59,22.91 63.7,21.79 63.7,19.28 63.14,18.72 62.31,18.72 IC4.14
  Bottom 0.406: v58.95,25.98 58.95,17.6 60.35,16.2 60.91,16.2 61.47,16.76 61.47,21.51 61.19,21.79 61.19,22.63 v61.47,22.91
N$34
  Top 0.406: R8.1 17.6,36.04 17.32,36.04 15.93,34.65 15.93,26.26 19.82,22.36 20.73,22.36 21.41,21.69 21.41,21.61 24.59,18.44 24.59,18.16 25.15,17.6 25.98,17.6 IC5.13
N$35  (via drill 0.35)
  Top 0.406: v19.28,24.03 16.48,26.82 16.48,34.09 17.04,34.65 17.6,34.65 R8.2 | v28.78,19.56 28.78,17.6 27.38,16.2 26.26,16.2 IC5.12
  Bottom 0.406: v19.28,24.03 24.31,24.03 v28.78,19.56
N$36  (via drill 0.35)
  Top 0.406: v20.12,33.53 R8.3 | v31.57,19.56 27.1,15.09 26.26,15.09 IC5.11
  Bottom 0.406: v20.12,33.53 20.37,33.27 35.46,33.27 37.16,31.57 37.16,28.5 40.79,24.87 40.79,22.07 38.28,19.56 v31.57,19.56
N$37  (via drill 0.35)
  Top 0.406: R8.4 17.86,32.38 v20.62,32.38 | v27.1,29.34 27.1,27.25 33.73,20.62 33.73,17.3 27.89,11.46 25.15,11.46 24.59,12.01 24.59,12.57 25.43,13.41 25.98,13.41 IC5.10
  Bottom 0.406: v20.62,32.38 24.05,32.38 v27.1,29.34
N$38  (via drill 0.35)
  Top 0.406: v20.62,30.99 R8.5 | v26.26,28.78 26.26,26.49 32.41,20.34 32.41,17.88 27.1,12.57 26.26,12.57 IC5.9
  Bottom 0.406: v20.62,30.99 24.05,30.99 v26.26,28.78
N$39
  Top 0.406: R8.6 17.88,29.62 19.56,29.62 22.63,26.54 22.63,22.91 25.43,20.12 25.98,20.12 IC5.15
N$40
  Top 0.406: 25.43,18.72 25.98,18.72 IC5.14 25.53,18.67 21.72,22.48 21.72,26.62 20.12,28.22 17.88,28.22 R8.7
N$41  (via drill 0.35)
  Top 0.406: v7.82,35.48 7.26,36.04 6.15,36.04 R9.1 | v13.97,20.12 13.97,18.44 13.13,17.6 12.29,17.6 IC6.13
  Bottom 0.406: v7.82,35.48 7.82,32.97 10.62,30.18 10.62,23.47 v13.97,20.12
N$42  (via drill 0.35)
  Top 0.406: v11.46,29.9 6.71,34.65 6.15,34.65 R9.2 | v15.09,26.26 15.09,24.87 16.74,23.22 v16.74,16.76 | v14.25,16.76 13.69,16.76 13.13,16.2 12.29,16.2 IC6.12
  Bottom 0.406: v15.09,26.26 v11.46,29.9 | v14.25,16.76 v16.74,16.76
N$43  (via drill 0.35)
  Top 0.406: v4.47,20.12 2.79,21.79 2.79,30.73 5.03,32.97 5.31,32.97 5.87,33.53 R9.3 | v10.62,15.65 11.18,15.09 12.01,15.09 IC6.11
  Bottom 0.406: v4.47,20.12 8.94,15.65 v10.62,15.65
N$44  (via drill 0.35)
  Top 0.406: v11.71,26.11 11.29,26.53 11.29,27.61 6.7,32.2 6.11,32.2 R9.4 | v14.05,24.54 14.15,24.54 15.93,22.76 15.93,15.37 14.25,13.69 12.29,13.69 IC6.10
  Bottom 0.406: v14.05,24.54 12.47,26.11 v11.71,26.11
N$45
  Top 0.406: R9.5 5.87,30.73 5.31,30.73 3.35,28.78 3.35,25.98 9.78,19.56 9.78,13.97 11.18,12.57 12.01,12.57 IC6.9
N$46
  Top 0.406: R9.6 6.15,29.62 6.71,29.62 10.62,25.7 10.62,20.95 11.46,20.12 12.01,20.12 IC6.15
N$47
  Top 0.406: R9.7 6.15,28.22 6.71,28.22 10.06,24.87 10.06,20.12 11.46,18.72 12.01,18.72 IC6.14
VCC  (via drill 0.35)
  Top 0.406: v32.69,30.45 35.48,30.45 37.44,28.5 40.23,28.5 LED1.A | v22.91,27.94 22.91,27.1 23.19,26.82 23.19,24.03 25.98,21.23 IC5.16 | v13.13,22.07 12.29,21.23 IC6.16 | v62.03,22.07 62.03,21.23 IC4.16 | v22.35,19.56 23.62,18.29 23.62,12.14 31.29,4.47 37.16,4.47 38.56,3.07 U1.5V
  Bottom 0.406: v32.69,30.45 29.34,30.45 26.82,27.94 v22.91,27.94 19.84,27.94 16.34,24.45 | v13.13,22.07 13.97,22.07 16.34,24.45 | v62.03,22.07 62.03,15.93 55.32,9.22 49.45,9.22 44.7,4.47 40.23,4.47 38.84,3.07 U1.5V | 16.34,24.45 21.23,19.56 v22.35,19.56

### Text on the board
tPlace: HDG SEL / For Arduino | Designed by / Zhengqi Wang | Oct, 2021